# Altium schematic sheet Peripheral.SchDoc
size A4; DocumentNumber: 2; SheetNumber: 2; SheetTotal: 4
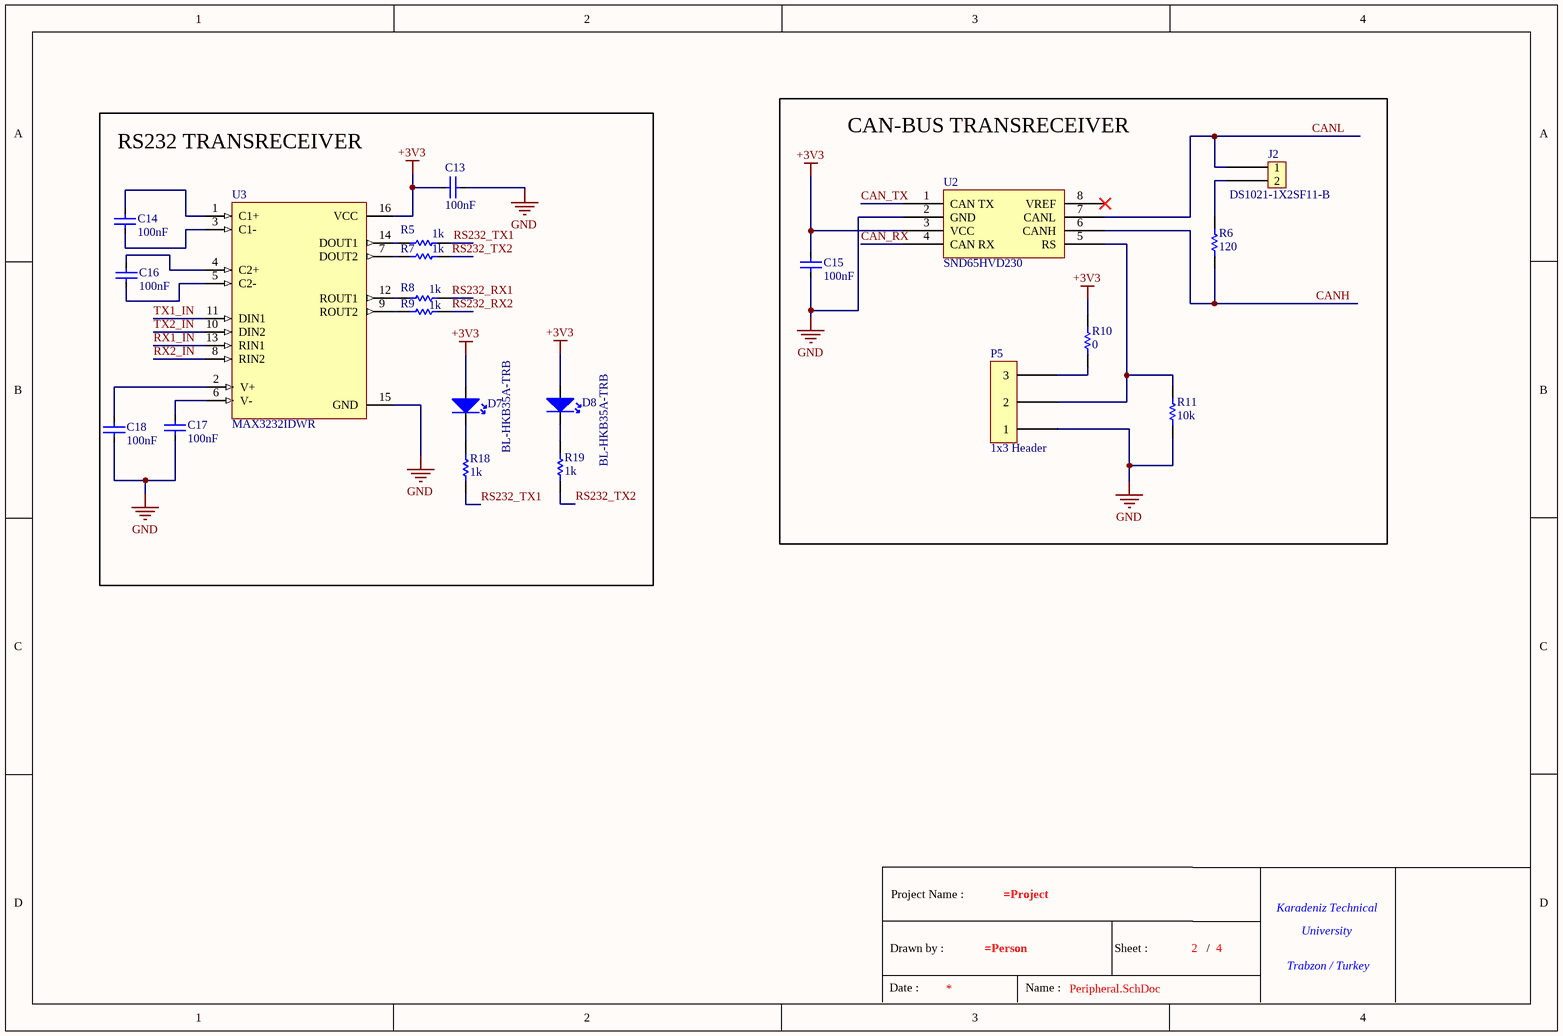
[diagram p0: Peripheral.SchDoc]

## Parts
*  Title Block  (value not drawn)  (graphical)
C13  100nF  [CAP-0603]
C14  100nF  [CAP-0603]
C15  100nF  [CAP-0603]
C16  100nF  [CAP-0603]
C17  100nF  [CAP-0603]
C18  100nF  [CAP-0603]
D7  BL-HKB35A-TRB  [LED-0805]
D8  BL-HKB35A-TRB  [LED-0805]
J2  DS1021-1X2SF11-B  [1x2 HEADER]
P5  1x3 Header  [1x3 Header (2.54 mm)]
R5  1k  [RES-0603]
R6  120  [RES-0603]
R7  1k  [RES-0603]
R8  1k  [RES-0603]
R9  1k  [RES-0603]
R10  0  [RES-0603]
R11  10k  [RES-0603]
R18  1k  [RES-0603]
R19  1k  [RES-0603]
U2  SND65HVD230  [SOIC-8]
U3  MAX3232IDWR  [SOIC-16]

## Blocks framed on the sheet
RS232 TRANSRECEIVER: C13 C14 C16-C18 D7 D8 R5 R7-R9 R18 R19 U3
CAN-BUS TRANSRECEIVER: C15 J2 P5 R6 R10 R11 U2

## Nets
+3V3: C13.2 C15.1 D7.1(A) D8.1(A) R10.2 U2.3(VCC) U3.16(VCC)
GND: C13.1 C15.2 C17.2 C18.2 P5.1 R11.1 U2.2(GND) U3.15(GND)
CAN_RX: U2.4(CAN_RX)
CAN_TX: U2.1(CAN_TX)
CANH: R6.2 U2.6(CANH)
CANL: J2.1 U2.7(CANL)
RS232_RX1: R8.1
RS232_RX2: R9.1
RS232_TX1: R5.1 R18.2
RS232_TX2: R7.1 R19.2
RX1_IN: U3.13(RIN1)
RX2_IN: U3.8(RIN2)
TX1_IN: U3.11(DIN1)
TX2_IN: U3.10(DIN2)
NetC14_1: C14.1 U3.1(C1+)
NetC14_2: C14.2 U3.3(C1-)
NetC16_1: C16.1 U3.4(C2+)
NetC16_2: C16.2 U3.5(C2-)
NetC17_1: C17.1 U3.6(V-)
NetC18_1: C18.1 U3.2(V+)
NetD7_2: D7.2(K) R18.1
NetD8_2: D8.2(K) R19.1
NetJ2_2: J2.2 R6.1
NetP5_2: P5.2 R11.2 U2.5(RS)
NetP5_3: P5.3 R10.1
NetR5_2: R5.2 U3.14(DOUT1)
NetR7_2: R7.2 U3.7(DOUT2)
NetR8_2: R8.2 U3.12(ROUT1)
NetR9_2: R9.2 U3.9(ROUT2)

Not connected (* = marked no-connect by the designer): U2 8(VREF)*

## Notes on the sheet
- (in symbol Title Block) Project Name :; Karadeniz Technical; University; Drawn by :; Sheet :; /; Trabzon / Turkey; Date :; Name :

## Library data of the parts
* = Title Block: Standart Title Block
C13-C18 = CGA3E2X7R1H104K080AA: Manufacturer: TDK; Temperature Coefficient: X7R; Voltage: 50V; Library Reference: Capacitor; Tolerance: %10; Man Code: CGA3E2X7R1H104K080AA; Value: 100nF; Footprint: 0603; Component Type: Ceramic Capacitor
D7 D8 = BL-HKB35A-TRB: Manufacturer: BRIGHT LED; Colour: Yellow; Vf: 2.2V; Library Reference: Miscellaneous; Luminous Intensity: 94mcd; If: 20mA; Lens Transparency: Water Clear; Man Code: BL-HKB35A-TRB; Footprint: 0805; Component Type: Led
J2 = DS1021-1X2SF11-B: Manufacturer: KLS Electronic; Number of Row: 1; Pitch: 2.54mm; Component Type: Header; Man Code: DS1021-1X2SF11-B; Number of Pins: 2
P5 = 1x3 Header: Contact Number: 3; Gender: Male; Mounting Angle: 180; Number of Row: 1; Pitch: 2.54 mm; Component Type: Connector; Footprint: *; Library Reference: *; Man Code: 1x3 Header; Mounting Style: THT
R5 R7-R9 R18 R19 = CRCW06031K00FKEAC: Manufacturer: Vishay; Library Reference: Resistor; Tolerance: %1; Power: 0.1W; Man Code: CRCW06031K00FKEAC; Footprint: 0603; Component Type: Chip Resistor; Value: 1k
R6 = RC0603FR-07120RL: Manufacturer: YAGEO; Compnenet Type: Chip Resistor; Tolerance: %1; Voltage: 75V; Man Code: RC0603FR-07120RL; Value: 120; Footprint: 0603
R10 = 0603SAJ0000T5E: Manufacturer: ROYALOHM; Tolerance: %5; Voltage: 75V; Component Type: Chip Resistor; Value: 0; Man Code: 0603SAJ0000T5E; Footprint: 0603
R11 = CRCW060310K0FKEA: Manufacturer: Vishay; Tolerance: %1; Power: 0.1W; Library Reference: Resistor; Man Code: CRCW060310K0FKEA; Value: 10k; Footprint: 0603; Component Type: Chip Resistor
U2 = SND65HVD230: Manufacturer: TI; Man Code: SN65HVD230; Component Type: CAN-BUS Transreceiver
U3 = MAX3232IDWR: Manufacturer: Texas; Supply Voltage: 3V to 5V; Data Rate: 250kbps; Man Code: MAX3232IDWR; Component Type: IC Driver